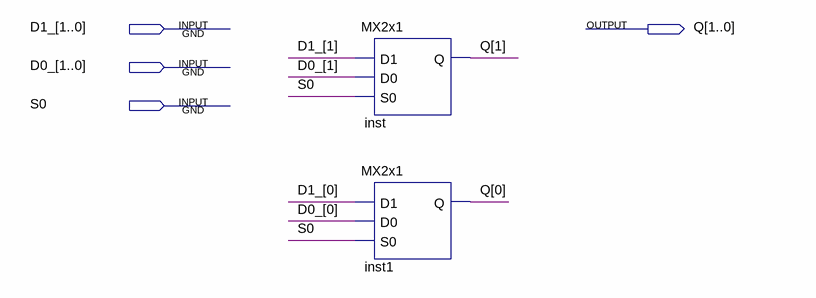
[diagram p0: schematic sheet]
// Quartus schematic MX2x2.bdf as structural Verilog: 2 symbols, 4 pins
module MX2x2 (
  input  [1:0] D1_,
  input  [1:0] D0_,
  input  S0,
  output [1:0] Q
);

  MX2x1 inst (.D1(D1_[1]), .D0(D0_[1]), .S0(S0), .Q(Q[1]));
  MX2x1 inst1 (.D1(D1_[0]), .D0(D0_[0]), .S0(S0), .Q(Q[0]));
endmodule
